# EAGLE schematic OSB_GRF (EAGLE 9.5.1)
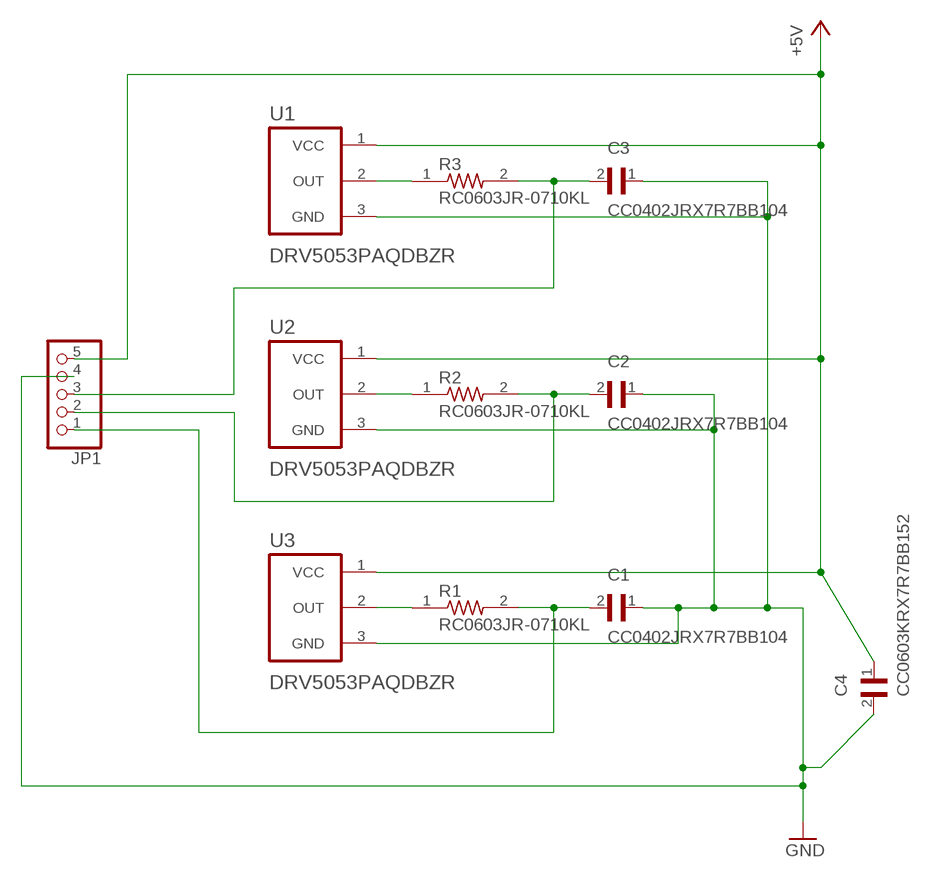
[diagram p0: schematic, sheet 1]

## Parts
C1  CC0402JRX7R7BB104  [CAPC1005X55N]
C2  CC0402JRX7R7BB104  [CAPC1005X55N]
C3  CC0402JRX7R7BB104  [CAPC1005X55N]
C4  CC0603KRX7R7BB152  [CAPC1608X90]
JP1  PINHD-1X55X2MM  [1_05X2MM]
R1  RC0603JR-0710KL  [RESC1607X60N]
R2  RC0603JR-0710KL  [RESC1607X60N]
R3  RC0603JR-0710KL  [RESC1607X60N]
U1  DRV5053PAQDBZR  [SOT95P237X112-3N]
U2  DRV5053PAQDBZR  [SOT95P237X112-3N]
U3  DRV5053PAQDBZR  [SOT95P237X112-3N]

## Nets
+5V: C4.1 JP1.5 U1.1(VCC) U2.1(VCC) U3.1(VCC)
GND: C1.1 C2.1 C3.1 C4.2 JP1.4 U1.3(GND) U2.3(GND) U3.3(GND)
N$1: R1.1 U3.2(OUT)
N$2: R2.1 U2.2(OUT)
N$3: R3.1 U1.2(OUT)
N$4: C1.2 JP1.1 R1.2
N$5: C2.2 JP1.2 R2.2
N$6: C3.2 JP1.3 R3.2

## Library data of the parts
C1-C3 = CC0402JRX7R7BB104:CC0402JRX7R7BB104: CAP CER 0.1UF 16V X7R 0402; DESCRIPTION: Cap Ceramic 0.1uF 16V X7R 5% SMD 0402 125°C Paper T/R; DIGI-KEY_PART_NUMBER: 311-1676-1-ND; DIGI-KEY_PURCHASE_URL: https://www.digikey.com/product-detail/en/yageo/CC0402JRX7R7BB104/311-1676-1-ND/5195578?utm_source=snapeda&utm_medium=aggregator&utm_campaign=symbol; MF: Yageo; MP: CC0402JRX7R7BB104; PACKAGE: 0402 Yageo
C4 = CC0603KRX7R7BB152:CC0603KRX7R7BB152: 0603 1.5 nF 16 V ±10 % Tolerance X7R SMT Multilayer Ceramic Capacitor; DESCRIPTION: 0603 1.5 nF 16 V ±10 % Tolerance X7R SMT Multilayer Ceramic Capacitor; DIGI-KEY_PART_NUMBER: 311-4064-1-ND; DIGI-KEY_PURCHASE_URL: https://www.digikey.com/product-detail/en/yageo/CC0603KRX7R7BB152/311-4064-1-ND/8025153?utm_source=snapeda&utm_medium=aggregator&utm_campaign=symbol; MF: Yageo; MP: CC0603KRX7R7BB152; PACKAGE: 0603 Yageo
JP1 = pinhead:PINHD-1X5: PIN HEADER
R1-R3 = RC0603JR-0710KL:RC0603JR-0710KL: RC Series 0603 0.1 W 10 kOhms 5% ±100 ppm/°C SMT Thick Film Chip Resistor; DESCRIPTION: RC Series 0603 0.1 W 10 kOhms 5% ±100 ppm/°C SMT Thick Film Chip Resistor; DIGI-KEY_PART_NUMBER: 311-10KGRCT-ND; DIGI-KEY_PURCHASE_URL: https://www.digikey.com/product-detail/en/yageo/RC0603JR-0710KL/311-10KGRCT-ND/729647?utm_source=snapeda&utm_medium=aggregator&utm_campaign=symbol; MF: Yageo; MP: RC0603JR-0710KL; PACKAGE: 0603 Yageo
U1-U3 = DRV5053PAQDBZR:DRV5053PAQDBZR: SENSOR LINEAR ANALOG SOT23-3; DESCRIPTION: 2.5 to 38 V Analog Bipolar Hall Effect Sensor 3-SOT-23 -40 to 125; DIGI-KEY_PART_NUMBER: 296-38458-1-ND; DIGI-KEY_PURCHASE_URL: https://www.digikey.com/product-detail/en/texas-instruments/DRV5053PAQDBZR/296-38458-1-ND/5022223?utm_source=snapeda&utm_medium=aggregator&utm_campaign=symbol; MF: Texas Instruments; MP: DRV5053PAQDBZR; PACKAGE: SOT-23-3 Texas Instruments